# Altium schematic sheet MDL-LCD_2X16.SchDoc
size A4; DocumentNumber: 10; SheetNumber: 10
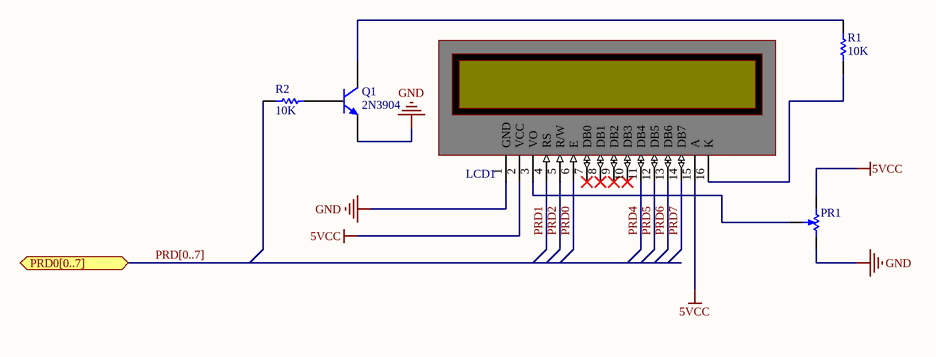
[diagram p0: MDL-LCD_2X16.SchDoc]

## Parts
LCD1  LCD 16X2  [LCD 16x2-A]  (value not drawn)
PR1  PT  [potenciometro]  (value not drawn)
Q1  2N3904  [2N3904_OK]
R1  value 10K  [AXIAL-0.3]  (hidden comment: Res)
R2  value 10K  [AXIAL-0.3]  (hidden comment: Res)

## Ports
PRD0[0..7] (bidir)

## Nets
5VCC: LCD1.2(VCC) LCD1.15(A) PR1.CCW(-)
GND: LCD1.1(GND) PR1.CW(+) Q1.1(E)
PRD0: LCD1.6(E)
PRD1: LCD1.4(RS)
PRD2: LCD1.5(R/W)
PRD4: LCD1.11(DB4)
PRD5: LCD1.12(DB5)
PRD6: LCD1.13(DB6)
PRD7: LCD1.14(DB7)
NetLCD1_3: LCD1.3(VO) PR1.W
NetLCD1_16: LCD1.16(K) R1.1
NetQ1_2: Q1.2(B) R2.1
NetQ1_3: Q1.3(C) R1.2

Not connected (* = marked no-connect by the designer): LCD1 7(DB0)* 8(DB1)* 9(DB2)* 10(DB3)*; R2 2

## Buses and harness runs
bus PRD[0..7] = port PRD0[0..7]

## Library data of the parts
LCD1 = LCD 16X2: LCD 16X2 Character lcd
PR1 = RPot SM: Square Trimming Potentiometer; Published: 17-Dec-2003; PackageReference: POT4MM-2; Publisher: Altium Limited; DatasheetVersion: Oct-2003; PackageDescription: Square Trimming Potentiometer; ComponentLink1Description: Manufacturer Link; ComponentLink1URL: http://bourns.com/2/search.html
Q1 = 2N3904: NPN General Purpose Amplifier; Published: 8-Jun-2000; LatestRevisionDate: 15-Jan-2003; LatestRevisionNote: PCB Footprint 'BCY-W3/D4.7' replaced; DatasheetVersion: 1997; PackageVersion: Sep-1998; PackageReference: TO-92A; Publisher: Altium Limited; ComponentLink1Description: Manufacturer Link; ComponentLink1URL: http://www.fairchildsemi.com/; ComponentLink2Description: Datasheet; ComponentLink2URL: http://www.fairchildsemi.com/ds/2N%2F2N3904.pdf; PackageDescription: TO, Flat Index; 3 In-Line, Axial Leads; Body Dia. 4.5mm; Leads 0.51 x 0.48 mm (max)
R1 R2 = Res1: Resistor; Published: 8-Jun-2000; LatestRevisionDate: 17-Jul-2002; LatestRevisionNote: Re-released for DXP Platform.; PackageReference: AXIAL-0.3; Publisher: Altium Limited